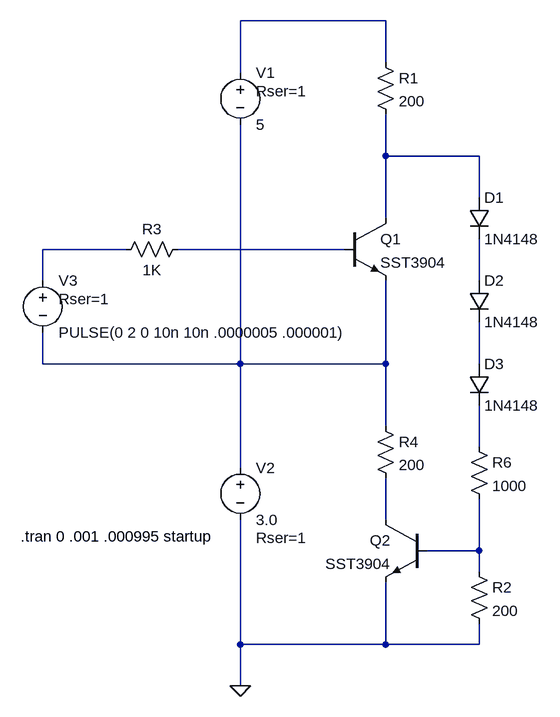
[diagram p0: schematic logicShift.asc]
logicShift.asc, the LTspice schematic file:
Version 4
SHEET 1 920 788
WIRE 240 -256 16 -256
WIRE 240 -192 240 -256
WIRE 16 -176 16 -256
WIRE 240 -48 240 -112
WIRE 384 -48 240 -48
WIRE 384 16 384 -48
WIRE 240 48 240 -48
WIRE -160 96 -288 96
WIRE 176 96 -80 96
WIRE -288 144 -288 96
WIRE 384 144 384 80
WIRE -288 272 -288 224
WIRE 16 272 16 -96
WIRE 16 272 -288 272
WIRE 240 272 240 144
WIRE 240 272 16 272
WIRE 384 272 384 208
WIRE 240 368 240 272
WIRE 384 400 384 336
WIRE 16 432 16 272
WIRE 240 512 240 448
WIRE 384 560 384 480
WIRE 384 560 304 560
WIRE 384 592 384 560
WIRE 16 704 16 512
WIRE 240 704 240 608
WIRE 240 704 16 704
WIRE 384 704 384 672
WIRE 384 704 240 704
WIRE 16 768 16 704
FLAG 16 768 0
SYMBOL npn 176 48 R0
SYMATTR InstName Q1
SYMATTR Value SST3904
SYMBOL res 224 -208 R0
SYMATTR InstName R1
SYMATTR Value 200
SYMBOL res 368 576 R0
SYMATTR InstName R2
SYMATTR Value 200
SYMBOL npn 304 512 M0
SYMATTR InstName Q2
SYMATTR Value SST3904
SYMBOL diode 368 16 R0
SYMATTR InstName D1
SYMATTR Value 1N4148
SYMBOL diode 368 144 R0
SYMATTR InstName D2
SYMATTR Value 1N4148
SYMBOL diode 368 272 R0
SYMATTR InstName D3
SYMATTR Value 1N4148
SYMBOL voltage 16 -192 R0
WINDOW 123 0 0 Left 2
WINDOW 39 24 44 Left 2
SYMATTR InstName V1
SYMATTR Value 5
SYMATTR SpiceLine Rser=1
SYMBOL voltage 16 416 R0
WINDOW 123 0 0 Left 2
WINDOW 39 24 124 Left 2
SYMATTR InstName V2
SYMATTR Value 3.0
SYMATTR SpiceLine Rser=1
SYMBOL voltage -288 128 R0
WINDOW 123 0 0 Left 2
WINDOW 39 24 44 Left 2
SYMATTR InstName V3
SYMATTR Value PULSE(0 2 0 10n 10n .0000005 .000001)
SYMATTR SpiceLine Rser=1
SYMBOL res -64 80 R90
WINDOW 0 0 56 VBottom 2
WINDOW 3 32 56 VTop 2
SYMATTR InstName R3
SYMATTR Value 1K
SYMBOL res 224 352 R0
SYMATTR InstName R4
SYMATTR Value 200
SYMBOL res 368 384 R0
SYMATTR InstName R6
SYMATTR Value 1000
TEXT -322 538 Left 2 !.tran 0 .001 .000995 startup

The netlist it stands for:
* logicShift.asc
Q1 N002 N004 N006 0 SST3904
R1 N001 N002 200
R2 N010 0 200
Q2 N009 N010 0 0 SST3904
D1 N002 N005 1N4148
D2 N005 N007 1N4148
D3 N007 N008 1N4148
V1 N001 N006 5 Rser=1
V2 N006 0 3.0 Rser=1
V3 N003 N006 PULSE(0 2 0 10n 10n .0000005 .000001) Rser=1
R3 N004 N003 1K
R4 N006 N009 200
R6 N008 N010 1000
.model D D
.lib standard.dio
.model NPN NPN
.model PNP PNP
.lib standard.bjt
.tran 0 .001 .000995 startup
.backanno
.end